# EAGLE design EC_isolated_SMD (EAGLE 6.2)
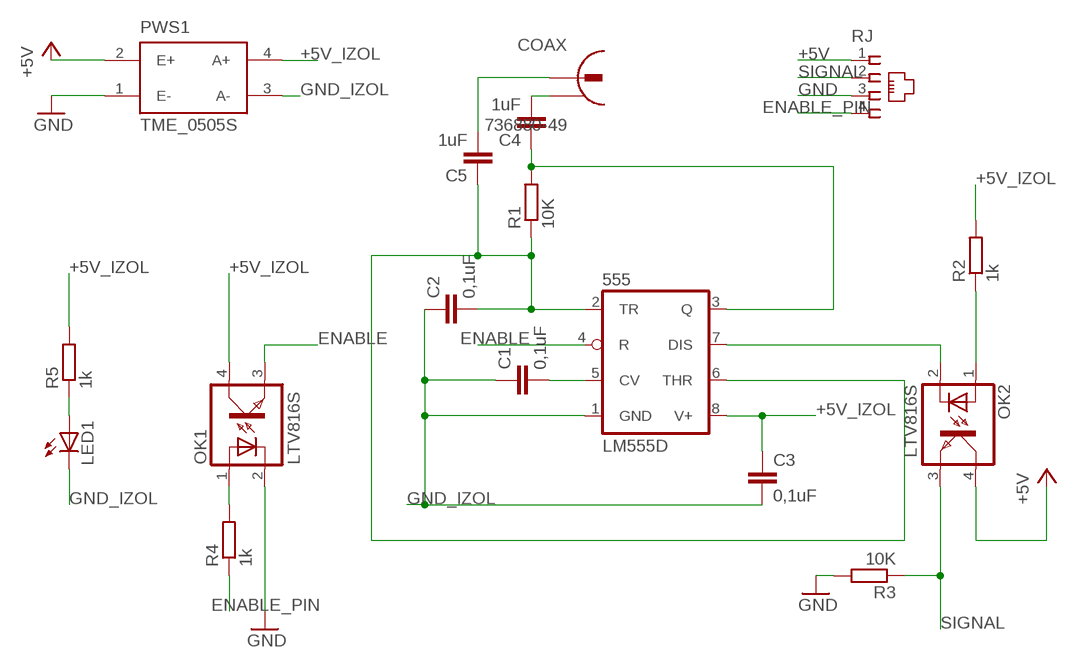
[diagram p0: schematic, sheet 1]

## Parts
555  LM555D  [SO08]
C1  0,1uF  C-EUC1206  [C1206]
C2  0,1uF  C-EUC1206  [C1206]
C3  0,1uF  C-EUC1206  [C1206]
C4  1uF  C-EUC1206  [C1206]
C5  1uF  C-EUC1206  [C1206]
COAX  736880-49  [736880-49]
LED1  LEDLZR181  [LZR181]
OK1  LTV816S  [SMD4]
OK2  LTV816S  [SMD4]
PWS1  TME_0505S  [TMEXXXXS]
R1  10K  R-EU_R1206W  [R1206W]
R2  1k  R-EU_R1206W  [R1206W]
R3  10K  R-EU_R0805W  [R0805W]
R4  1k  R-EU_R1206W  [R1206W]
R5  1k  R-EU_R0805W  [R0805W]
RJ  14867  [14867]

## Nets
+5V: OK2.4(COL) PWS1.2(E+) RJ.1
+5V_IZOL: 555.8(V+) C3.1 OK1.4(COL) PWS1.4(A+) R2.2 R5.2
ENABLE: 555.4(R) OK1.3(EMIT)
ENABLE_PIN: R4.1 RJ.4
GND: OK1.2(C) PWS1.1(E-) R3.2 RJ.3
GND_IZOL: 555.1(GND) C1.1 C2.1 C3.2 LED1.K(C) PWS1.3(A-)
N$1: 555.3(Q) C4.1 R1.2
N$2: OK2.1(A) R2.1
N$3: 555.2(TR) 555.6(THR) C2.2 C5.1 R1.1
N$4: C4.2 COAX.2
N$5: 555.5(CV) C1.2
N$6: LED1.A R5.1
N$7: 555.7(DIS) OK2.2(C)
N$8: OK1.1(A) R4.2
N$9: C5.2 COAX.1
SIGNAL: OK2.3(EMIT) R3.1 RJ.2
Unconnected: COAX.2@2

## Library data of the parts
555 = linear:*555: TIMER
C1-C5 = rcl:C-EU: CAPACITOR, European symbol
COAX = Sensuino:736880-49: Cinch Connector ( RCA Jack )
LED1 = led:LED: LED OSRAM: - CHIPLED LG R971, LG N971, LY N971, LG Q971, LY Q971, LO R971, LY R971 LH N974, LH R974 LS Q976, LO Q976, LY Q976 LO Q996 - Hyper CHIPLED LW Q18S LB Q993, LB Q99A, LB R99A - SideLED LS A670, LO A670, LY A670, LG A670, LP A670 LB A673, LV A673, LT A673, LW A673 LH A674 LY A675 LS A676, LA A676, LO A676, LY A676, LW A676 LS A679, LY A679, LG A679 - Hyper Micro SIDELED® LS Y876, LA Y876, LO Y876, LY Y876 LT Y87S - SmartLED LW L88C, LW L88S LB L89C, LB L89S, LG L890 LS L89K, LO L89K, LY L89K LS L896, LA L896, LO L896, LY L896 - TOPLED LS T670, LO T670, LY T670, LG T670, LP T670 LSG T670, LSP T670, LSY T670, LOP T670, LYG T670 LG T671, LOG T671, LSG T671 LB T673, LV T673, LT T673, LW T673 LH T674 LS T676, LA T676, LO T676, LY T676, LB T676, LH T676, LSB T676, LW T676 LB T67C, LV T67C, LT T67C, LS T67K, LO T67K, LY T67K, LW E67C LS E67B, LA E67B, LO E67B, LY E67B, LB E67C, LV E67C, LT E67C LW T67C LS T679, LY T679, LG T679 LS T770, LO T770, LY T770, LG T770, LP T770 LB T773, LV T773, LT T773, LW T773 LH T774 LS E675, LA E675, LY E675, LS T675 LS T776, LA T776, LO T776, LY T776, LB T776 LHGB T686 LT T68C, LB T68C - Hyper Mini TOPLED® LB M676 - Mini TOPLED Santana® LG M470 LS M47K, LO M47K, LY M47K Source: http://www.osram.convergy.de LUXEON: - LUMILED® LXK2-PW12-R00, LXK2-PW12-S00, LXK2-PW14-U00, LXK2-PW14-V00 LXK2-PM12-R00, LXK2-PM12-S00, LXK2-PM14-U00 LXK2-PE12-Q00, LXK2-PE12-R00, LXK2-PE12-S00, LXK2-PE14-T00, LXK2-PE14-U00 LXK2-PB12-K00, LXK2-PB12-L00, LXK2-PB12-M00, LXK2-PB14-N00, LXK2-PB14-P00, LXK2-PB14-Q00 LXK2-PR12-L00, LXK2-PR12-M00, LXK2-PR14-Q00, LXK2-PR14-R00 LXK2-PD12-Q00, LXK2-PD12-R00, LXK2-PD12-S00 LXK2-PH12-R00, LXK2-PH12-S00 LXK2-PL12-P00, LXK2-PL12-Q00, LXK2-PL12-R00 Source: www.luxeon.com KINGBRIGHT: KA-3528ASYC Source: www.kingbright.com
OK1 OK2 = optocoupler:LTV816: OPTO COUPLER Source: LITEON, LTV816.pdf; OC_FARNELL: unknown; OC_NEWARK: unknown
PWS1 = traco-electronic:TME_*S: DC/DC Konverter 1 Watt Source: http://www.tracopower.com/datasheet_g/tme-d.pdf; MPN: TME 0505S; OC_FARNELL: 1007538; OC_NEWARK: 51R5321
R1-R5 = rcl:R-EU_: RESISTOR, European symbol
RJ = RJ11:14867: RJ11 Connector Source: 4UCON TECHNOLOGY INC. 14867.pdf; OC_FARNELL: unknown; OC_NEWARK: unknown

## Board
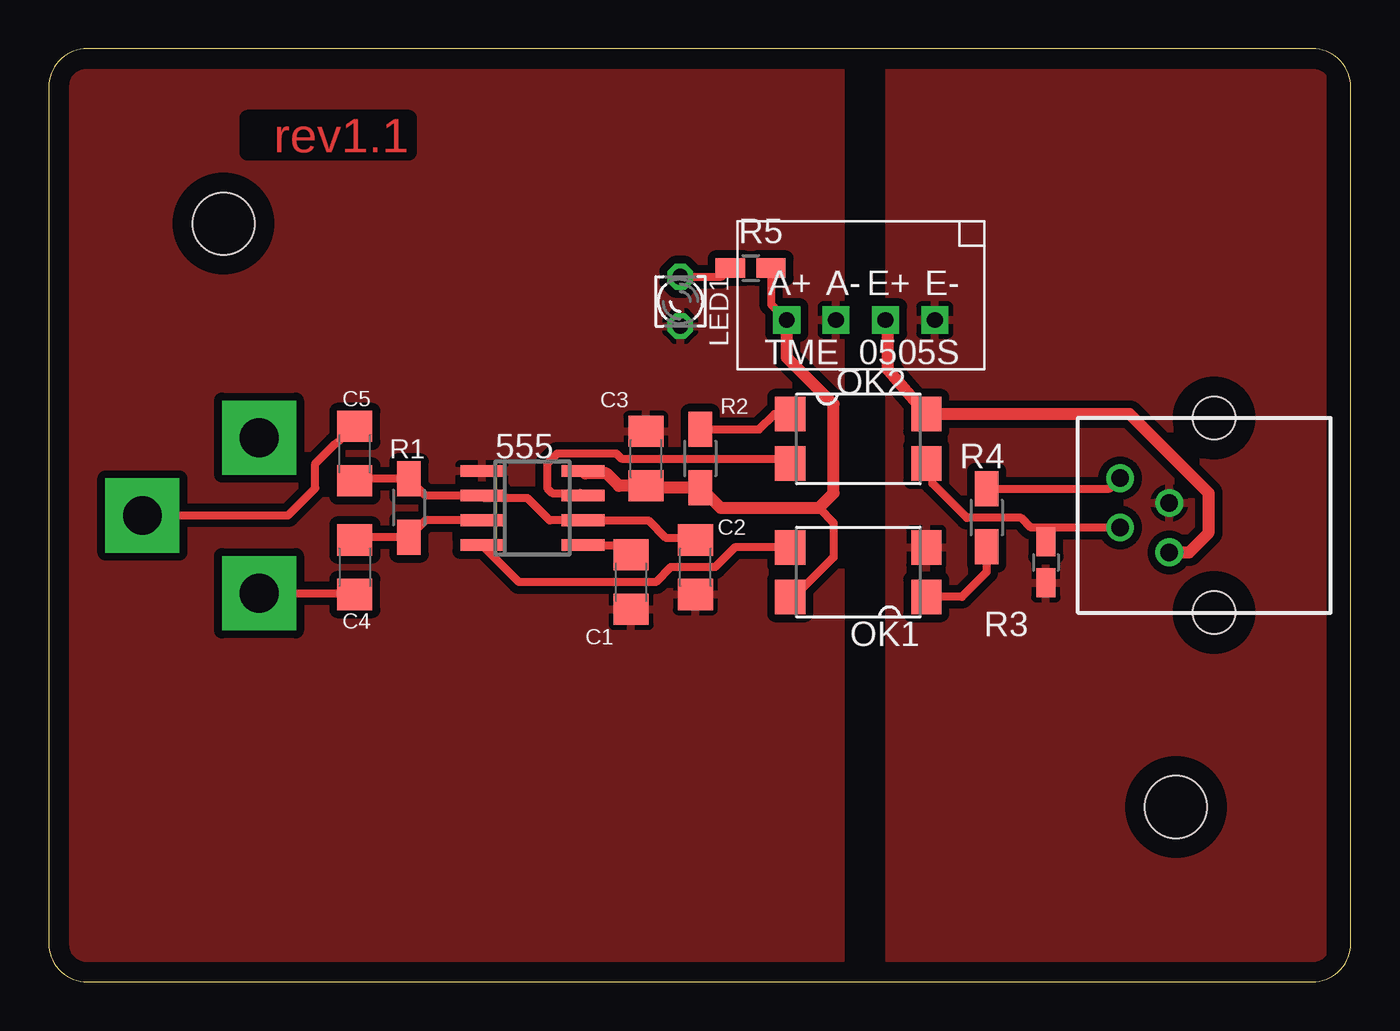
[diagram p1: board, top side]
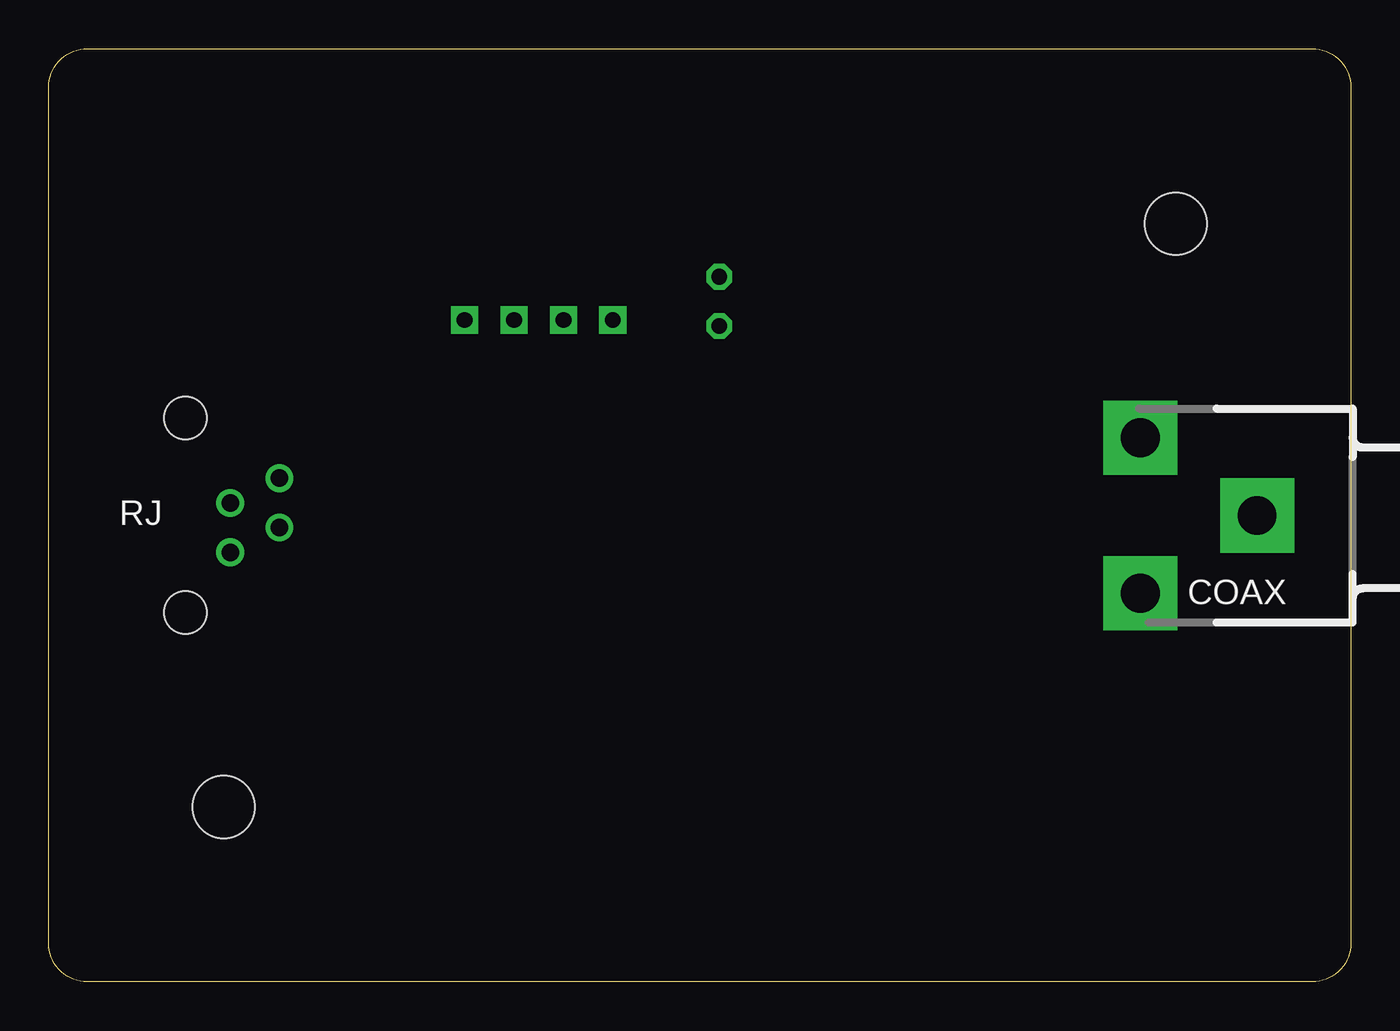
[diagram p2: board, bottom side, seen from below]

Size 67 x 48 mm. Coordinates in mm from the lower left corner, seen from the top.
Outline: 0,46 0,2 arc90 2,0 65,0 arc90 67,2 67,46 arc90 65,48 2,48 arc90 0,46
Copper layers (1*16): Top 0.035mm / dielectric 1.5mm / Bottom 0.035mm
Design rules "default": minimum track width 10mil, minimum drill 24mil, track to track 8mil, track to pad 8mil, pad to pad 8mil, via to via 8mil, smd to smd 8mil, copper to edge 40mil, drill to drill 8mil, minimum pad ring 10mil, minimum via ring 8mil, stop-mask expansion 4mil, vias tented up to drill 0mil, thermal gap 10mil
Holes 3.2 mm at 9,39 58,9

### Footprints (pad centres in the part's own frame; a part is rotated, then mirrored left to right if it is on the bottom)
SO08 = smd 0.6 x 2.2: 1 -1.905,-2.6; 2 -0.635,-2.6; 3 0.635,-2.6; 4 1.905,-2.6; 5 1.905,2.6; 6 0.635,2.6; 7 -0.635,2.6; 8 -1.905,2.6
C1206 = smd 1.6 x 1.8: 1 -1.4,0; 2 1.4,0
736880-49 = drill 2 pad 3.81 square: 1 0,0; 2 6,4; 2@2 6,-4
LZR181 = drill 0.813 octagon: A -1.27,0; K 1.27,0
SMD4 = smd 1.78 x 1.55: 1 -1.27,-3.5; 2 1.27,-3.5; 3 1.27,3.5; 4 -1.27,3.5
TMEXXXXS = drill 0.813 pad 1.397 square: 1 -3.81,1.27; 2 -1.27,1.27; 3 1.27,1.27; 4 3.81,1.27
R1206W = smd 1.8 x 1.2: 1 -1.499,0; 2 1.499,0
R0805W = smd 1.5 x 1: 1 -1.052,0; 2 1.052,0
14867 = drill 0.9 pad 1.422: 1 -1.905,6.35; 2 -0.635,8.89; 3 0.635,6.35; 4 1.905,8.89 | hole 2.2: -5,4.05; 5,4.05

### Placement (x,y rotation side)
555  24.89,24.38 270 top
C1  29.97,20.57 90 top
C2  33.27,21.33 90 top
C3  30.73,26.92 90 top
C4  15.75,21.33 270 top
C5  15.75,27.17 90 top
COAX  4.83,23.99 180 bottom
LED1  32.5,35 270 top
OK1  41.66,21.07 90 top
OK2  41.66,27.93 270 top
PWS1  41.78,35.31 180 top
R1  18.54,24.38 270 top
R2  33.53,26.92 270 top
R3  51.31,21.58 270 top
R4  48.26,23.87 270 top
R5  36.12,36.71 0 top
RJ  64.01,24 90 top

### Tracks (layer width: path | path; a pad name or v marks a point on that pad's centre or on a via)
+5V
  Top 0.61: RJ.1 58.68,22.09 59.69,23.11 59.69,25.14 55.63,29.2 OK2.4 43.18,31.49 43.18,33.92 PWS1.2
+5V_IZOL
  Top 0.406: OK1.4 38.35,19.8 40.39,21.84 40.39,23.61 39.62,24.38 | 30.83,25.42 C3.1 | 27.62,26.15 555.8 | R5.2 37.17,34.85 PWS1.4
  Top 0.61: 30.83,25.42 R2.2 34.57,24.38 39.62,24.38 40.39,25.14 40.39,29.71 37.97,32.12 PWS1.4 | C3.1 29.34,25.52 28.7,26.15 27.62,26.15
ENABLE
  Top 0.406: OK1.3 35.31,22.34 34.29,21.33 32,21.33 31.24,20.57 24.2,20.57 555.4
ENABLE_PIN
  Top 0.406: R4.1 54.58,25.37 RJ.4
GND
  pour Top (isolate 0.406): 43.25,46.88 65.52,46.88 65.52,1.12 43.25,1.12
GND_IZOL
  pour Top (isolate 0.406): 0.98,1.12 0.98,46.88 40.75,46.88 40.75,1.12
N$1
  Top 0.406: 18.54,23.11 R1.2 | R1.2 15.75,22.88 C4.1 | 555.3 19.41,23.74 R1.2
N$2
  Top 0.406: OK2.1 37.34,29.2 36.55,28.41 R2.1
N$3
  Top 0.406: 18.54,25.65 R1.1 | R1.1 15.75,25.88 C5.1 | R1.1 19.41,25.01 555.2 22.42,24.88 24.64,24.88 25.78,23.74 555.6 30.86,23.74 31.75,22.85 33.25,22.85 C2.2
N$4
  Top 0.406: COAX.2 15.75,19.99 C4.2
N$5
  Top 0.406: 555.5 29.47,22.47 C1.2
N$6
  Top 0.406: LED1.A 34.62,36.27 R5.1
N$7
  Top 0.406: 555.7 27.36,25.14 25.91,25.14 25.65,25.39 25.65,26.66 26.16,27.17 29.21,27.17 29.46,26.92 37.9,26.92 OK2.2
N$8
  Top 0.406: R4.2 48.26,21.07 46.99,19.8 OK1.1
N$9
  Top 0.406: COAX.1 12.31,23.99 13.72,25.39 13.72,26.66 14.73,27.68 14.76,27.68 C5.2 15.49,28.42
SIGNAL
  Top 0.406: RJ.2 51.5,23.36 | 51.5,23.36 50.54,23.36 50.04,23.87 47.24,23.87 45.47,25.65 45.47,26.35 OK2.3 | R3.1 51.31,23.17 51.5,23.36

### Text on the board
Top: rev1.1
Name: EC | by Sensuino